# EAGLE design x8 (EAGLE 7.5.0)
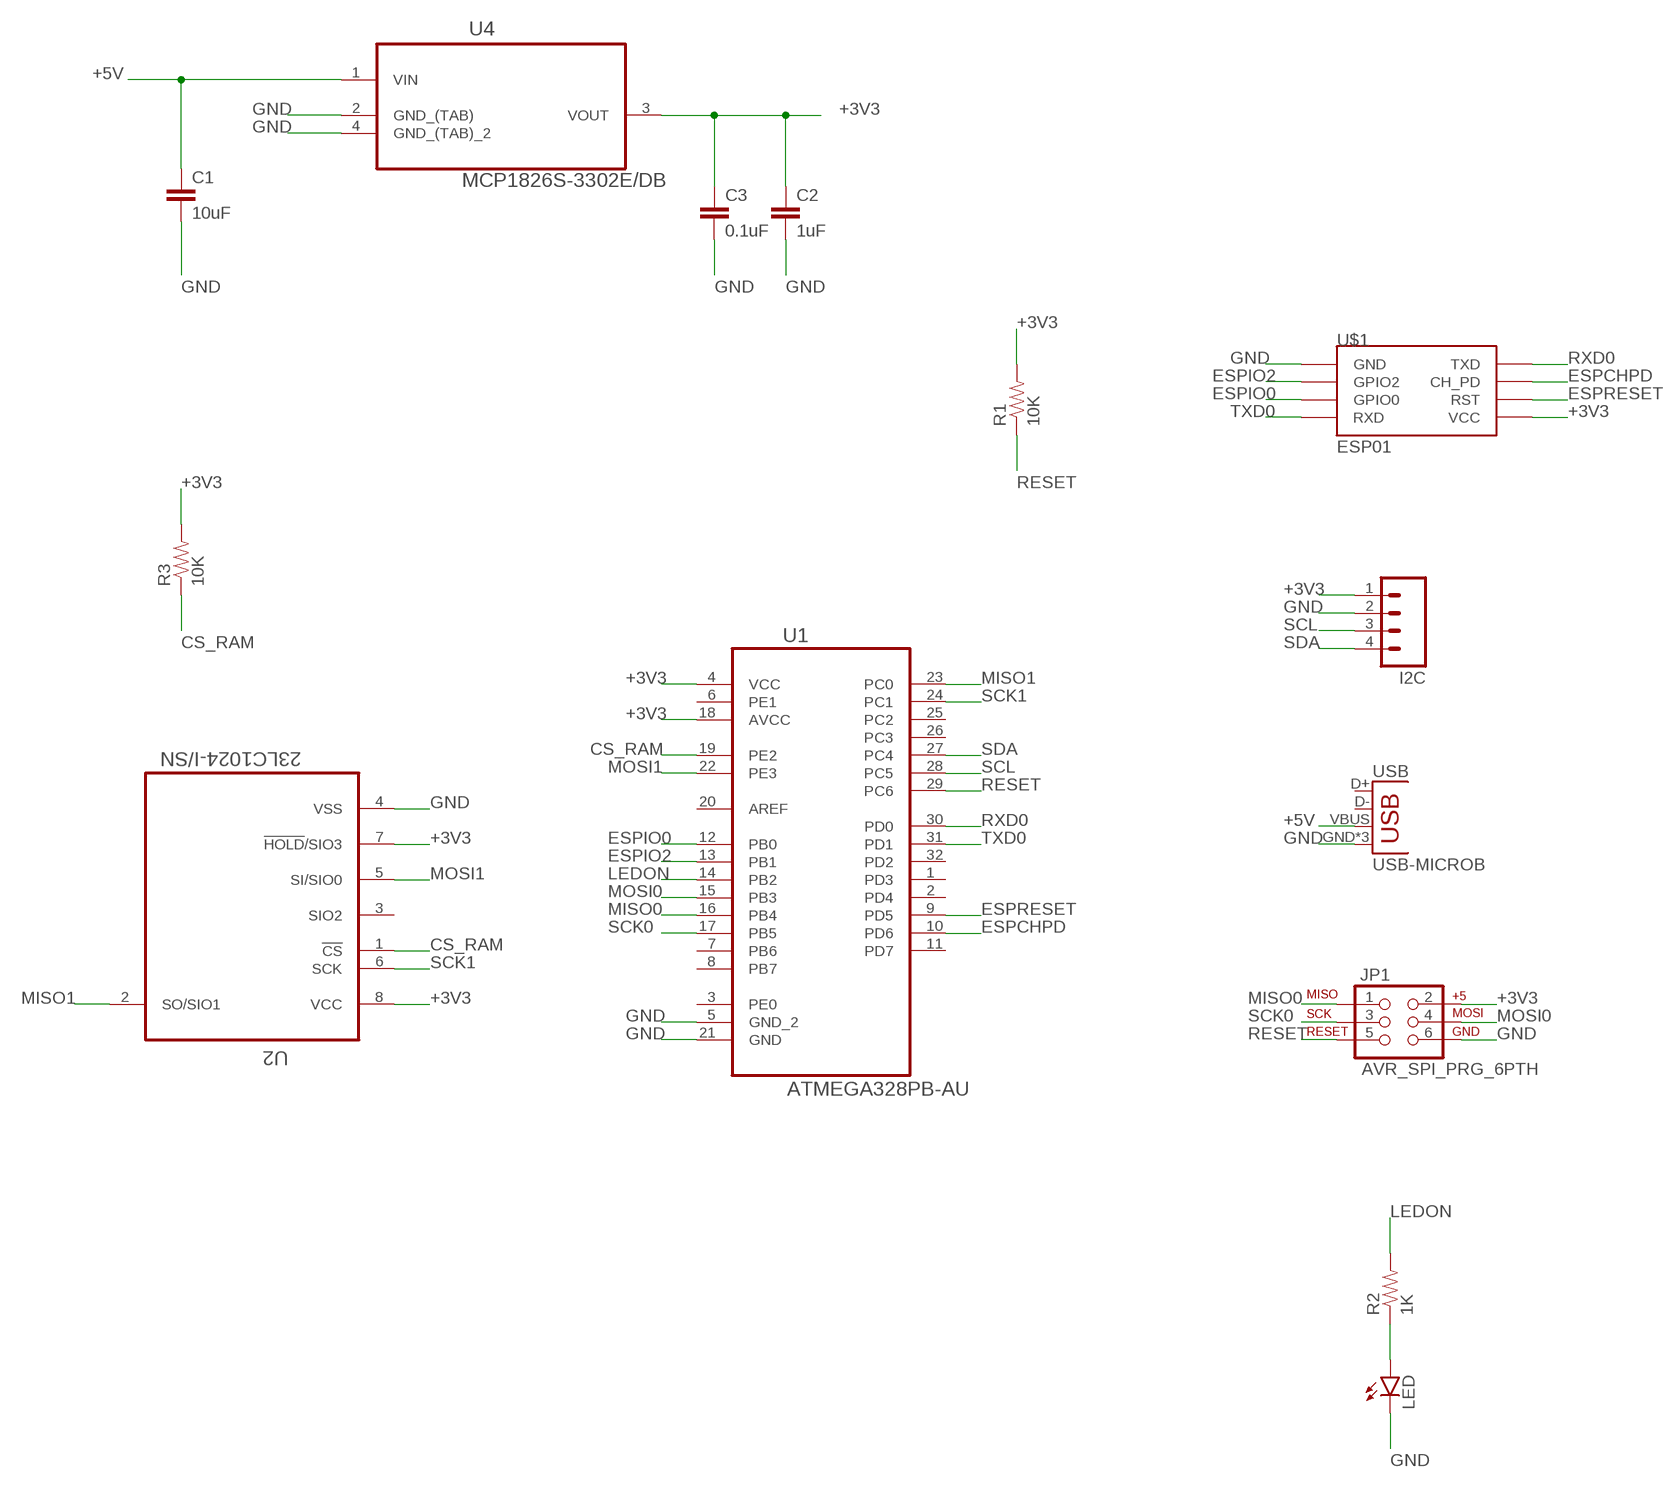
[diagram p0: schematic, sheet 1]

## Parts
C1  10uF  CAP0402-CAP  [0402-CAP]
C2  1uF  CAP0402-CAP  [0402-CAP]
C3  0.1uF  CAP0402-CAP  [0402-CAP]
I2C  M04PTH  [1X04]
JP1  AVR_SPI_PRG_6PTH  [2X3]
LED  LED0603  [LED-0603]
R1  10K  RESISTOR0402  [0402-RES]
R2  1K  RESISTOR0402  [0402-RES]
R3  10K  RESISTOR0402  [0402-RES]
U1  ATMEGA328PB-AU  [QFP80P900X900X120-32N]
U2  23LC1024-I/SN  [SOIC127P600X175-8N]
U4  MCP1826S-3302E/DB  [SOT230P700X180-4N]
U$1  ESP01  [ESP01]
USB  USB-MICROB  [USB-MICROB]

## Nets
+3V3: C2.1 C3.1 I2C.1 JP1.2 R1.2 R3.2 U1.4(VCC) U1.18(AVCC) U2.7(!HOLD!/SIO3) U2.8(VCC) U4.3(VOUT) U$1.VCC
+5V: C1.1 U4.1(VIN) USB.VBUS
CS_RAM: R3.1 U1.19(PE2) U2.1(!CS)
ESPCHPD: U1.10(PD6) U$1.CH_PD
ESPIO0: U1.12(PB0) U$1.GPIO0
ESPIO2: U1.13(PB1) U$1.GPIO2
ESPRESET: U1.9(PD5) U$1.RST
GND: C1.2 C2.2 C3.2 I2C.2 JP1.6 LED.C U1.5(GND_2) U1.21(GND) U2.4(VSS) U4.2(GND_(TAB)) U4.4(GND_(TAB)_2) U$1.GND USB.GND USB.MT1(GND) USB.MT2(GND)
LEDON: R2.2 U1.14(PB2)
MISO0: JP1.1 U1.16(PB4)
MISO1: U1.23(PC0) U2.2(SO/SIO1)
MOSI0: JP1.4 U1.15(PB3)
MOSI1: U1.22(PE3) U2.5(SI/SIO0)
N$2: LED.A R2.1
RESET: JP1.5 R1.1 U1.29(PC6)
RXD0: U1.30(PD0) U$1.TX(TXD)
SCK0: JP1.3 U1.17(PB5)
SCK1: U1.24(PC1) U2.6(SCK)
SCL: I2C.3 U1.28(PC5)
SDA: I2C.4 U1.27(PC4)
TXD0: U1.31(PD1) U$1.RX(RXD)
Unconnected: U1.1(PD3) U1.2(PD4) U1.3(PE0) U1.6(PE1) U1.7(PB6) U1.8(PB7) U1.11(PD7) U1.20(AREF) U1.25(PC2) U1.26(PC3) U1.32(PD2) U2.3(SIO2) USB.D+ USB.D-

## Library data of the parts
C1-C3 = SparkFun-Capacitors:CAP: Capacitor Standard 0603 ceramic capacitor, and 0.1" leaded capacitor.
I2C = SparkFun-Connectors:M04: Header 4 Standard 4-pin 0.1" header. Use with straight break away headers (SKU : PRT-00116), right angle break away headers (PRT-00553), swiss pins (PRT-00743), machine pins (PRT-00117), and female headers (PRT-00115). Molex polarized connector foot print use with SKU : PRT-08231 with associated crimp pins and housings. 1MM SMD Version SKU: PRT-10208
JP1 = SparkFun-Connectors:AVR_SPI_PRG_6: AVR ISP 6 Pin This is the reduced ISP connector for AVR programming. Common on Arduino. This footprint will take up less PCB space and can be used with a 10-pin to 6-pin adapter such as SKU: BOB-08508 **Special note about "TEST_POINT" package. The stop mask is on the top side, so if you want your programming test points to be on the bottom of your board, make sure to place this package on the bottom side of the board. This also ensure that the orientation to program from the bottom side will be correct.
LED = SparkFun-LED:LED: LEDs Standard schematic elements and footprints for 5mm, 3mm, 1206, and 0603 sized LEDs. 5mm - Spark Fun Electronics SKU : COM-00529 (and others)
R1-R3 = SparkFun-Resistors:RESISTOR: Resistor Basic schematic elements and footprints for 0603, 1206, and PTH resistors.
U1 = lone-dynamics:ATMEGA328PB-AU: 8-bit Microcontroller with In-System Programmable Flash; MPN: ATMEGA328P-AU; OC_FARNELL: 1715486; OC_NEWARK: 14R4631; PACKAGE: TQFP-32; SUPPLIER: Atmel
U2 = microchip-sram-2014:23LC1024-I/SN: 1Mbit SPI Serial SRAM,SOIC-8; MPN: 23LC1024-I/SN; OC_FARNELL: 2212150; OC_NEWARK: 94T8231; PACKAGE: SOIC-8; SUPPLIER: MICROCHIP
U4 = Microchip_By_element14_Batch_1:MCP1826S-3302E/DB: IC, LDO, 3.3V, 1A; MPN: MCP1826S-3302E/DB; OC_FARNELL: 1578424; OC_NEWARK: 27M0037; PACKAGE: SOT-223-3; SUPPLIER: Microchip
U$1 = esp8266modules:ESP01: ESP8266 Wifi module 01
USB = SparkFun-Connectors:USB: USB Connectors USB-B-PTH is fully proven SKU : PRT-00139/CONN-08278 USB-miniB is fully proven SKU : PRT-00587 USB-A-PCB is untested. USB-A-H is throughly reviewed, but untested. Spark Fun Electronics SKU : PRT-00437 USB-B-SMT is throughly reviewed, but untested. Needs silkscreen touching up. USB-A-S has not been used/tested USB-MB-H has not been used/tested USB-MICROB has been used. CONN-09505; PROD_ID: CONN-09505

## Board
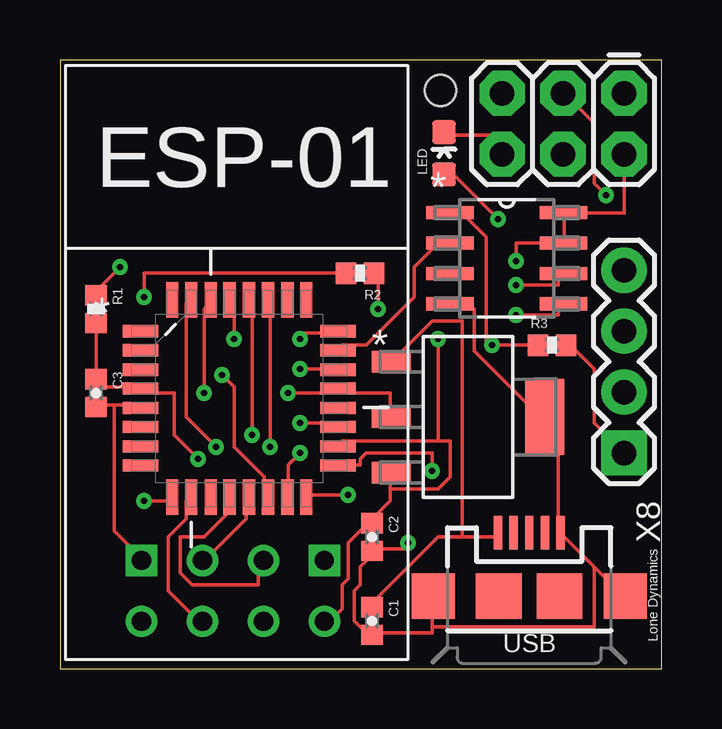
[diagram p1: board, top side]
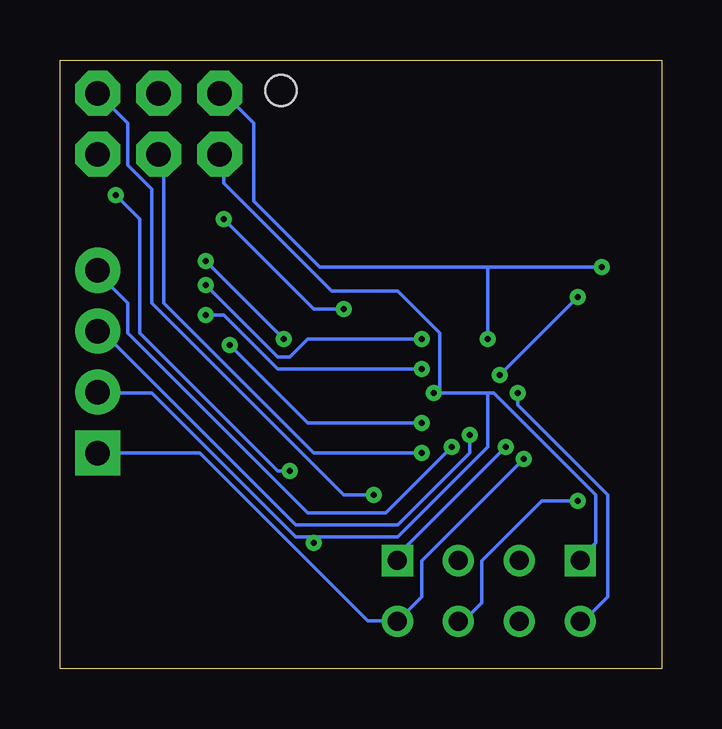
[diagram p2: board, bottom side, seen from below]

Size 25.07 x 25.39 mm. Coordinates in mm from the lower left corner, seen from the top.
Outline: 0,0 25.07,0 25.07,25.39 0,25.39 0,0
Copper layers (1*16): Top 0.035mm / dielectric 1.5mm / Bottom 0.035mm
Design rules "default *": minimum track width 6mil, minimum drill 10mil, track to track 6mil, track to pad 8mil, pad to pad 8mil, via to via 8mil, smd to smd 8mil, copper to edge 40mil, drill to drill 8mil, minimum pad ring 10mil, minimum via ring 8mil, stop-mask expansion 4mil, vias tented up to drill 0mil, thermal gap 10mil
Holes 1.3 mm at 15.86,24.12
tRestrict: area 0,17.5 to 14.5,25.5
bRestrict: area 0,17.5 to 14.5,25.5

### Footprints (pad centres in the part's own frame; a part is rotated, then mirrored left to right if it is on the bottom)
0402-CAP = smd 0.85 x 0.9: 1 -0.58,0; 2 0.58,0
1X04 = drill 1.016 pad 1.88 square: 1 0,0 | drill 1.016 pad 1.88: 2 2.54,0; 3 5.08,0; 4 7.62,0
2X3 = drill 1.016 pad 1.88 octagon: 1 0,0; 2 0,2.54; 3 2.54,0; 4 2.54,2.54; 5 5.08,0; 6 5.08,2.54
LED-0603 = smd 1 x 1: A 0,-0.877; C 0,0.877
0402-RES = smd 0.85 x 0.9: 1 -0.58,0; 2 0.58,0
QFP80P900X900X120-32N = smd 1.473 x 0.508: 1 -4.115,2.794; 2 -4.115,2.007; 3 -4.115,1.194; 4 -4.115,0.406; 5 -4.115,-0.406; 6 -4.115,-1.194; 7 -4.115,-2.007; 8 -4.115,-2.794; 17 4.115,-2.794; 18 4.115,-2.007; 19 4.115,-1.194; 20 4.115,-0.406; 21 4.115,0.406; 22 4.115,1.194; 23 4.115,2.007; 24 4.115,2.794 | smd 0.508 x 1.473: 9 -2.794,-4.115; 10 -2.007,-4.115; 11 -1.194,-4.115; 12 -0.406,-4.115; 13 0.406,-4.115; 14 1.194,-4.115; 15 2.007,-4.115; 16 2.794,-4.115; 25 2.794,4.115; 26 2.007,4.115; 27 1.194,4.115; 28 0.406,4.115; 29 -0.406,4.115; 30 -1.194,4.115; 31 -2.007,4.115; 32 -2.794,4.115
SOIC127P600X175-8N = smd 1.981 x 0.559: 1 -2.362,1.905; 2 -2.362,0.635; 3 -2.362,-0.635; 4 -2.362,-1.905; 5 2.362,-1.905; 6 2.362,-0.635; 7 2.362,0.635; 8 2.362,1.905
SOT230P700X180-4N = smd 1.626 x 0.889: 1 -3.2,2.311; 2 -3.2,0; 3 -3.2,-2.311 | smd 1.626 x 3.175: 4 3.2,0
ESP01 = drill 0.8: CH_PD -1.285,-8.178; GPIO0 1.255,-5.638; GPIO2 -1.285,-5.638; RST 1.255,-8.178; TX -3.825,-8.178; VCC 3.795,-8.178 | drill 0.8 square: GND -3.825,-5.638; RX 3.795,-5.638
USB-MICROB = smd 0.35 x 1.4: D+ 0,2.65; D- -0.65,2.65; GND 1.3,2.65; ID 0.65,2.65; VBUS -1.3,2.65 | smd 1.8 x 1.9: MT1 -4,0; MT2 4,0 | smd 1.9 x 1.9: P$1 -1.27,0; P$2 1.27,0

### Placement (x,y rotation side)
C1  13,2 270 top
C2  13,5.5 270 top
C3  1.5,11.5 270 top
I2C  23.5,9 90 top
JP1  23.5,24 180 top
LED  16,21.5 0 top
R1  1.5,15 270 top
R2  12.5,16.5 180 top
R3  20.5,13.5 0 top
U1  7.47,11.28 0 top
U2  18.62,17.12 0 top
U4  17,10.5 0 top
U$1  7.22,10.16 0 top
USB  19.55,3.04 0 top

### Tracks (layer width: path | path; a pad name or v marks a point on that pad's centre or on a via)
+3V3  (via drill 0.25)
  Top 0.152: 21,19 21,18 U2.7 20.75,17.75 19,17.75 v19,17 | 21,19 23.5,19 JP1.2 | 21,19 U2.8 | I2C.1 22.25,10.25 22.25,12.5 21.25,13.5 R3.2 | R1.2 C3.1 1.5,11.75 3.25,11.75 U1.4 3.5,11.5 4.75,11.5 4.75,9.75 v5.75,8.75 | 13,6.25 13.75,7 13.75,7.5 | 13.75,7.5 13.75,8 U4.3 | 15.75,9.5 16.25,9.5 16.25,8 15.75,7.5 13.75,7.5 | 15.75,9.5 11.75,9.5 U1.18 | 13,6.25 12,5.25 12,3.75 11.75,3.5 11.75,2.5 11.25,2 U$1.VCC | 13,6.25 C2.1 | 15.75,9.5 v15.75,13.75
  Bottom 0.152: v5.75,8.75 10,4.5 10,3 11,2 U$1.VCC 11.25,2 12.25,2 19.25,9 I2C.1 | v15.75,13.75 v19,17
+5V
  Top 0.152: 16.75,5.5 18.25,5.5 USB.VBUS | 16.75,5.5 15.75,5.5 13,2.75 C1.1 | 16.75,5.5 16.75,14.5 15.5,14.5 14,13 U4.1
CS_RAM  (via drill 0.25)
  Top 0.152: R3.1 v18,13.5 17.75,13.5 17.75,18 16.5,19.25 U2.1 | v10,10.25 11.5,10.25 U1.19
  Bottom 0.152: v10,10.25 14.75,10.25 v18,13.5
ESPCHPD
  Top 0.152: U1.10 5.25,7 5.25,6.25 4.5,5.5 4.5,3.25 5.75,2 U$1.CH_PD
ESPIO0
  Top 0.152: U1.12 7,7 7,6.5 6,5.5 5,5.5 5,4 5.5,3.5 8.25,3.5 8.25,4.5 U$1.GPIO0
ESPIO2
  Top 0.152: U1.13 7.75,7 7.75,6.25 6,4.5 U$1.GPIO2
ESPRESET  (via drill 0.25)
  Top 0.152: v3.5,7 4.5,7 U1.9
  Bottom 0.152: v3.5,7 5,7 7.5,4.5 7.5,2.75 8.25,2 U$1.RST
GND  (via drill 0.25)
  Top 0.152: U2.4 16.5,15 17.25,15 17.25,13.25 20,10.5 U4.4 20.25,10.5 20.75,10 20.75,5.75 USB.GND 21,5.5 22.25,4.25 | 15.5,1.75 15.5,3 USB.MT1 | 15.5,1.75 15.5,1.5 13,1.5 C1.2 13,1.25 12.25,2 12.25,3.25 12.5,3.5 12.5,4.25 13,4.75 C2.2 13,5 14.5,5 v14.5,5.25 | 22.25,4.25 23.5,3 USB.MT2 | 15.5,1.75 22.25,1.75 22.25,4.25 | LED.C 16,22.25 18.25,22.25 18.25,21.5 JP1.6 | U4.2 13.75,10.5 13.75,11.5 11.75,11.5 U1.21 11.5,11.5 v9.5,11.5 | 2.25,11 3.25,11 U1.5 | 2.25,11 1.5,11 C3.2 | 2.25,11 2.25,5.75 3.25,4.75 U$1.GND
  Bottom 0.152: 7.25,11.5 7,11.5 2.75,7.25 2.75,5.25 3.25,4.75 U$1.GND | 7.25,11.5 9.25,11.5 | 14.5,5.5 11,5.5 7.25,9.25 7.25,11.5 | 14.5,5.5 15.25,5.5 21.25,11.5 23.5,11.5 I2C.2 | 9.25,11.5 9.25,14 11,15.75 13.75,15.75 18.25,20.25 18.25,21.25 JP1.6 | 9.25,11.5 v9.5,11.5 | 14.5,5.5 v14.5,5.25
LEDON  (via drill 0.25)
  Top 0.152: R2.2 3.5,16.5 v3.5,15.5 | v6.75,12.25 7.25,11.75 7.25,9.25 8.5,8 8.5,7.25 U1.14
  Bottom 0.152: v6.75,12.25 v3.5,15.5
MISO0  (via drill 0.25)
  Top 0.152: v12,7.25 10.5,7.25 U1.16
  Bottom 0.152: v12,7.25 13.25,7.25 21.25,15.25 21.25,20 22.25,21 22.25,22.75 JP1.1
MISO1
  Top 0.152: U1.23 11.75,13.5 12.75,13.5 14.75,15.5 14.75,16.75 15.75,17.75 U2.2
MOSI0  (via drill 0.25)
  Top 0.152: v10,9 9.5,8.5 9.5,7.25 U1.15
  Bottom 0.152: v10,9 14.5,9 20.75,15.25 20.75,21.25 JP1.4
MOSI1  (via drill 0.25)
  Top 0.152: v10,12.5 11.5,12.5 U1.22 | v19,14.75 20.75,14.75 20.75,15 U2.5
  Bottom 0.152: v10,12.5 16,12.5 18.25,14.75 v19,14.75
N$2  (via drill 0.25)
  Top 0.152: v13.25,15 13.25,16.5 R2.1 | v18.25,18.75 16.5,20.5 16,20.5 LED.A
  Bottom 0.152: v13.25,15 14.5,15 v18.25,18.75
RESET  (via drill 0.25)
  Top 0.152: v2.5,16.75 1.5,15.75 R1.1 | v7.25,13.75 7.25,15.25 U1.29
  Bottom 0.152: 7.25,16.75 14.25,16.75 17,19.5 17,22.75 18.25,24 JP1.5 | 7.25,16.75 v2.5,16.75 | 7.25,16.75 v7.25,13.75
RXD0  (via drill 0.25)
  Top 0.152: v6,11.5 6,15 6.25,15.25 U1.30
  Bottom 0.152: v6,11.5 6,11 2.25,7.25 2.25,3 3.25,2 U$1.TX
SCK0  (via drill 0.25)
  Top 0.152: v15.5,8.25 15.5,9 12.75,9 12.5,8.75 12.5,8.5 11.75,8.5 U1.17 | v22.75,19.75 22.25,20.25 22.25,22.75 21,24 JP1.3
  Bottom 0.152: v15.5,8.25 16,8.25 21.75,14 21.75,18.75 v22.75,19.75
SCK1  (via drill 0.25)
  Top 0.152: v10,13.75 10,14 11.5,14 U1.24 | v19,16 20.75,16 20.75,16.25 U2.6
  Bottom 0.152: v10,13.75 14.75,13.75 15.5,13 16,13 v19,16
SCL  (via drill 0.25)
  Top 0.152: v8,9.75 8,15.25 U1.28
  Bottom 0.152: v8,9.75 8,9 11,6 15.25,6 23.5,14.25 I2C.3
SDA  (via drill 0.25)
  Top 0.152: v8.75,9.25 8.75,15.25 U1.27
  Bottom 0.152: v8.75,9.25 11.5,6.5 14.75,6.5 22.25,14 22.25,15.25 23.5,16.5 I2C.4
TXD0  (via drill 0.25)
  Top 0.152: v6.5,9.25 5.25,10.5 5.25,15.25 U1.31
  Bottom 0.152: v6.5,9.25 11,4.75 U$1.RX

### Text on the board
tPlace: X8 | Lone Dynamics